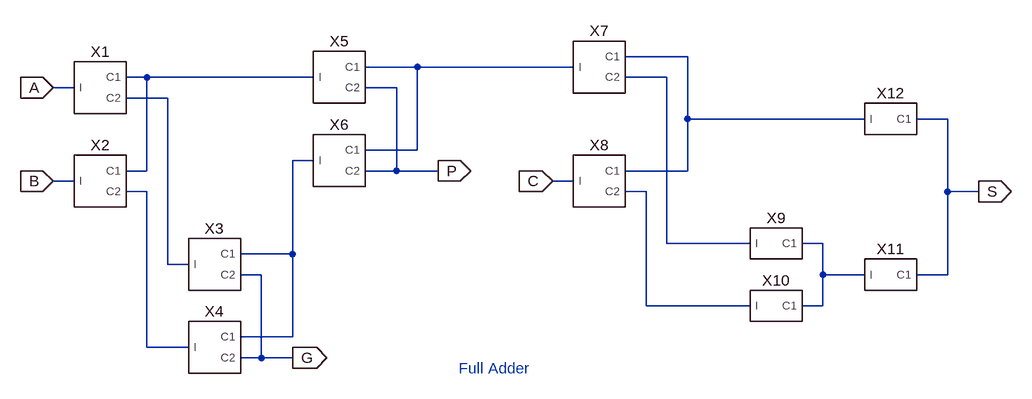
[diagram p0: schematic fag1p1.asc]
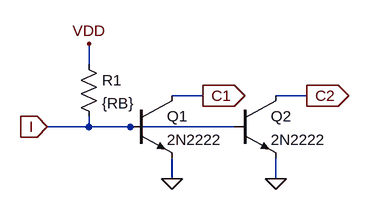
[diagram p1: sub-circuit iilg2.asc]
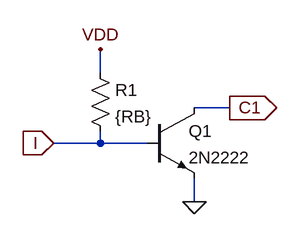
[diagram p2: sub-circuit iilg1.asc]
fag1p1.asc, the LTspice schematic file:
Version 4
SHEET 1 4164 944
WIRE 1264 -288 1168 -288
WIRE 848 -272 768 -272
WIRE 1088 -272 848 -272
WIRE 432 -256 400 -256
WIRE 688 -256 432 -256
WIRE 1232 -256 1168 -256
WIRE 320 -240 288 -240
WIRE 816 -240 768 -240
WIRE 464 -224 400 -224
WIRE 1264 -192 1264 -288
WIRE 1536 -192 1264 -192
WIRE 1664 -192 1616 -192
WIRE 848 -144 848 -272
WIRE 848 -144 768 -144
WIRE 688 -128 656 -128
WIRE 432 -112 432 -256
WIRE 432 -112 400 -112
WIRE 816 -112 816 -240
WIRE 816 -112 768 -112
WIRE 880 -112 816 -112
WIRE 1264 -112 1264 -192
WIRE 1264 -112 1168 -112
WIRE 320 -96 288 -96
WIRE 1088 -96 1056 -96
WIRE 432 -80 400 -80
WIRE 1200 -80 1168 -80
WIRE 1664 -80 1664 -192
WIRE 1712 -80 1664 -80
WIRE 1232 0 1232 -256
WIRE 1360 0 1232 0
WIRE 1472 0 1440 0
WIRE 656 16 656 -128
WIRE 656 16 576 16
WIRE 464 32 464 -224
WIRE 496 32 464 32
WIRE 608 48 576 48
WIRE 1472 48 1472 0
WIRE 1536 48 1472 48
WIRE 1664 48 1664 -80
WIRE 1664 48 1616 48
WIRE 1200 96 1200 -80
WIRE 1360 96 1200 96
WIRE 1472 96 1472 48
WIRE 1472 96 1440 96
WIRE 656 144 656 16
WIRE 656 144 576 144
WIRE 432 160 432 -80
WIRE 496 160 432 160
WIRE 608 176 608 48
WIRE 608 176 576 176
WIRE 656 176 608 176
FLAG 288 -240 A
IOPIN 288 -240 In
FLAG 288 -96 B
IOPIN 288 -96 In
FLAG 1056 -96 C
IOPIN 1056 -96 In
FLAG 656 176 G
IOPIN 656 176 Out
FLAG 880 -112 P
IOPIN 880 -112 Out
FLAG 1712 -80 S
IOPIN 1712 -80 Out
SYMBOL iilg2 352 -240 R0
SYMATTR InstName X1
SYMBOL iilg2 352 -96 R0
SYMATTR InstName X2
SYMBOL iilg2 528 32 R0
SYMATTR InstName X3
SYMBOL iilg2 528 160 R0
SYMATTR InstName X4
SYMBOL iilg2 720 -256 R0
SYMATTR InstName X5
SYMBOL iilg2 720 -128 R0
SYMATTR InstName X6
SYMBOL iilg2 1120 -272 R0
SYMATTR InstName X7
SYMBOL iilg1 1392 0 R0
SYMATTR InstName X9
SYMBOL iilg1 1392 96 R0
SYMATTR InstName X10
SYMBOL iilg1 1568 48 R0
SYMATTR InstName X11
SYMBOL iilg1 1568 -192 R0
SYMATTR InstName X12
SYMBOL iilg2 1120 -96 R0
SYMATTR InstName X8
TEXT 912 192 Left 2 ;Full Adder

iilg2.asc, the sub-circuit schematic file:
Version 4
SHEET 1 880 680
WIRE 384 240 384 208
WIRE 560 288 512 288
WIRE 720 288 672 288
WIRE 384 336 384 320
WIRE 384 336 320 336
WIRE 448 336 384 336
WIRE 608 336 448 336
WIRE 512 416 512 384
WIRE 672 416 672 384
FLAG 384 208 VDD
FLAG 320 336 I
IOPIN 320 336 In
FLAG 512 416 0
FLAG 560 288 C1
IOPIN 560 288 Out
FLAG 672 416 0
FLAG 720 288 C2
IOPIN 720 288 Out
SYMBOL npn 448 288 R0
SYMATTR InstName Q1
SYMATTR Value 2N2222
SYMBOL res 368 224 R0
SYMATTR InstName R1
SYMATTR Value {RB}
SYMBOL npn 608 288 R0
SYMATTR InstName Q2
SYMATTR Value 2N2222

iilg1.asc, the sub-circuit schematic file:
Version 4
SHEET 1 880 680
WIRE 384 240 384 208
WIRE 560 288 512 288
WIRE 384 336 384 320
WIRE 384 336 320 336
WIRE 448 336 384 336
WIRE 512 416 512 384
FLAG 512 416 0
FLAG 384 208 VDD
FLAG 320 336 I
IOPIN 320 336 In
FLAG 560 288 C1
IOPIN 560 288 Out
SYMBOL npn 448 288 R0
SYMATTR InstName Q1
SYMATTR Value 2N2222
SYMBOL res 368 224 R0
SYMATTR InstName R1
SYMATTR Value {RB}

The netlist it stands for:
* fag1p1.asc
XX1 A N003 N005 iilg2
XX2 B N003 N007 iilg2
XX3 N005 N006 G iilg2
XX4 N007 N006 G iilg2
XX5 N003 N002 P iilg2
XX6 N006 N002 P iilg2
XX7 N002 N001 N004 iilg2
XX9 N004 N009 iilg1
XX10 N008 N009 iilg1
XX11 N009 S iilg1
XX12 N001 S iilg1
XX8 C N001 N008 iilg2

* block symbol definitions
.subckt iilg2 I C1 C2
Q1 C1 I 0 0 2N2222
R1 VDD I {RB}
Q2 C2 I 0 0 2N2222
.ends iilg2

.subckt iilg1 I C1
Q1 C1 I 0 0 2N2222
R1 VDD I {RB}
.ends iilg1

.model NPN NPN
.model PNP PNP
.lib standard.bjt
* Full Adder
.backanno
.end